# EAGLE design ADUM1250ARZ v.02 (EAGLE 8.6.0)
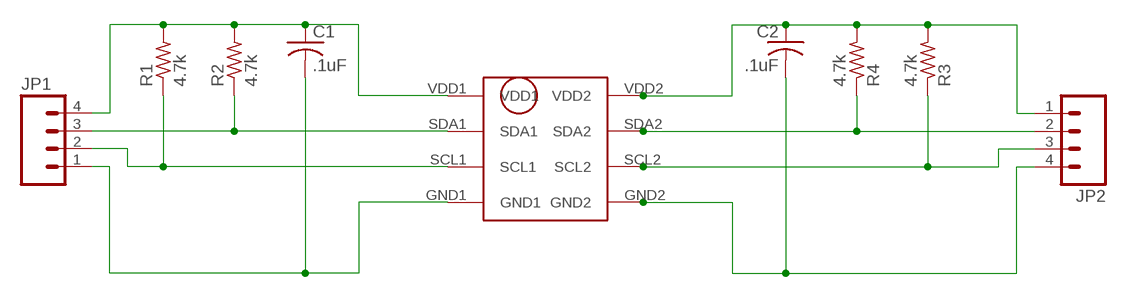
[diagram p0: schematic, sheet 1]

## Parts
C1  .1uF  C-USC0402  [C0402]
C2  .1uF  C-USC0402  [C0402]
JP1  M04PTH  [1X04]
JP2  M04PTH  [1X04]
R1  4.7k  R-US_R0402  [R0402]
R2  4.7k  R-US_R0402  [R0402]
R3  4.7k  R-US_R0402  [R0402]
R4  4.7k  R-US_R0402  [R0402]
U$1  ADUM1250ARZ  [ADUM1250ARZ]

## Nets
GND: C1.2 C2.2 JP1.1 JP2.4 U$1.GND1 U$1.GND2
SCL1: JP1.2 R1.1 U$1.SCL1
SCL2: JP2.3 R3.1 U$1.SCL2
SDA1: JP1.3 R2.1 U$1.SDA1
SDA2: JP2.2 R4.1 U$1.SDA2
VDD1: C1.1 JP1.4 R1.2 R2.2 U$1.VDD1
VDD2: C2.1 JP2.1 R3.2 R4.2 U$1.VDD2

## Library data of the parts
C1 C2 = resistor:C-US: CAPACITOR, American symbol
JP1 JP2 = SparkFun:M04: Header 4 Standard 4-pin 0.1" header. Use with straight break away headers (SKU : PRT-00116), right angle break away headers (PRT-00553), swiss pins (PRT-00743), machine pins (PRT-00117), and female headers (PRT-00115). Molex polarized connector foot print use with SKU : PRT-08231 with associated crimp pins and housings. 1MM SMD Version SKU: PRT-10208
R1-R4 = resistor:R-US_: RESISTOR, American symbol
U$1 = Random parts:ADUM1250ARZ

## Board
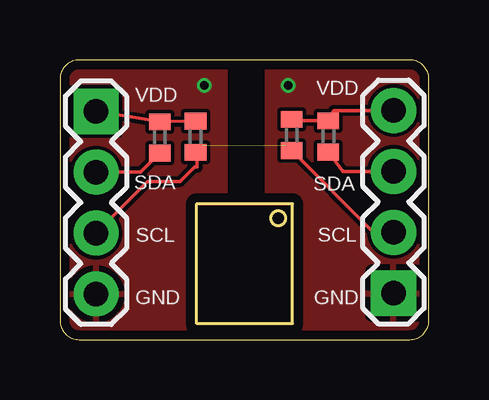
[diagram p1: board, top side]
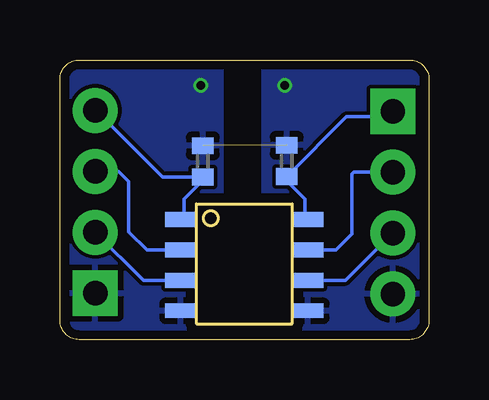
[diagram p2: board, bottom side, seen from below]

Size 15.39 x 11.67 mm. Coordinates in mm from the lower left corner, seen from the top.
Outline: 0,10.87 0,0.8 arc90 0.8,0 14.59,0 arc90 15.39,0.8 15.39,10.87 arc90 14.59,11.67 0.8,11.67 arc90 0,10.87
Copper layers (1*16): Top 0.035559375mm / dielectric 1.6mm / Bottom 0.035559375mm
Design rules "oshpark-2layer *": minimum track width 6mil, minimum drill 10mil, track to track 6mil, track to pad 6mil, pad to pad 6mil, via to via 6mil, smd to smd 6mil, copper to edge 15mil, drill to drill 6mil, minimum pad ring 5mil, minimum via ring 5mil, stop-mask expansion 2.5mil, vias tented up to drill 0.35mm, thermal gap 10mil

### Footprints (pad centres in the part's own frame; a part is rotated, then mirrored left to right if it is on the bottom)
C0402 = smd 0.7 x 0.9: 1 -0.65,0; 2 0.65,0
1X04 = drill 1.016 pad 1.88 square: 1 0,0 | drill 1.016 pad 1.88: 2 2.54,0; 3 5.08,0; 4 7.62,0
R0402 = smd 0.7 x 0.9: 1 -0.65,0; 2 0.65,0
ADUM1250ARZ = smd 1.3 x 0.61: GND1 -0.65,-4.455; GND2 4.65,-4.455; SCL1 -0.65,-3.185; SCL2 4.65,-3.185; SDA1 -0.65,-1.915; SDA2 4.65,-1.915; VDD1 -0.65,-0.645; VDD2 4.65,-0.645

### Placement (x,y rotation side)
C1  9.43,7.44 90 bottom
C2  5.93,7.46 90 bottom
JP1  13.92,1.94 90 top
JP2  1.51,9.53 270 top
R1  9.67,8.54 90 top
R2  11.19,8.48 90 top
R3  5.65,8.47 90 top
R4  4.16,8.44 90 top
U$1  9.7,5.66 0 bottom

### Tracks (layer width: path | path; a pad name or v marks a point on that pad's centre or on a via)
GND  (via drill 0.35)  (1 unrouted)
  other vias: 6.02,10.6 9.52,10.6
  pour Bottom: 0.12,11.6 0.12,0 6.92,0 6.92,11.6
  pour Top: 0.12,11.6 0.12,0 6.92,0 6.92,11.6
  pour Top: 8.62,11.6 8.62,0 15.42,0 15.42,11.6
  pour Bottom: 8.62,11.6 8.62,0 15.42,0 15.42,11.6
SCL1
  Top 0.152: R1.1 13.08,4.48 JP1.2
  Bottom 0.152: U$1.SCL1 11.91,2.48 JP1.2
SCL2
  Top 0.152: JP2.3 3.66,6.6 5.02,6.6 5.62,7.2 5.72,7.2 5.72,7.75 R3.1
  Bottom 0.152: U$1.SCL2 3.47,2.48 JP2.3
SDA1
  Top 0.152: R2.1 11.81,7.02 JP1.3
  Bottom 0.152: U$1.SDA1 11.76,3.75 12.52,4.5 12.52,6.6 12.94,7.02 JP1.3
SDA2
  Top 0.152: R4.1 3.36,6.99 JP2.2
  Bottom 0.152: U$1.SDA2 3.88,3.75 3.22,4.4 3.22,6.9 3.12,7 3.11,6.99 JP2.2
VDD1
  Top 0.152: JP1.4 11.42,9.56 R2.2 9.73,9.13 R1.2
  Bottom 0.152: U$1.VDD1 10.22,5.14 10.22,5.88 9.43,6.67 C1.1 11.11,6.79 13.88,9.56 JP1.4
VDD2
  Top 0.152: JP2.1 R4.2 R3.2
  Bottom 0.152: U$1.VDD2 5.18,5.14 5.18,5.88 5.93,6.63 C2.1 3.44,9.3 1.73,9.3 JP2.1

### Text on the board
tNames: VDD | VDD | SDA | SDA | SCL | SCL | GND | GND